# EAGLE schematic pgab (EAGLE 7.4.0)
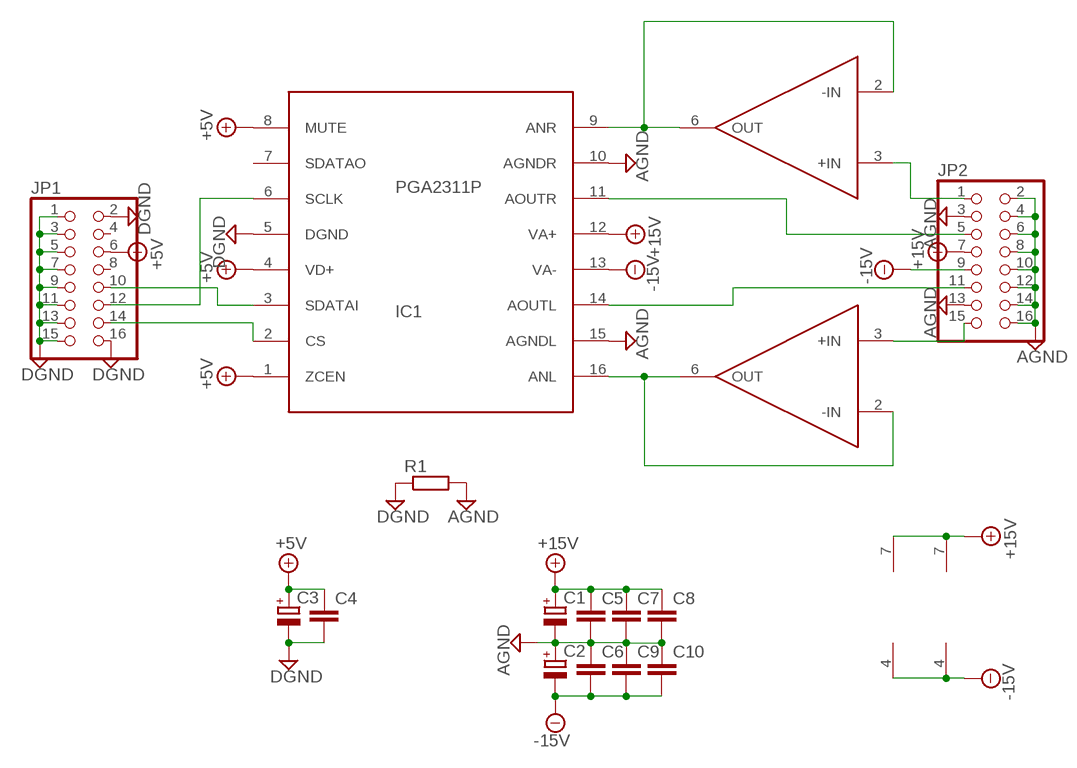
[diagram p0: schematic, sheet 1]

## Parts
C1  CPOL-EUE3.5-8  [E3,5-8]
C2  CPOL-EUE3.5-8  [E3,5-8]
C3  CPOL-EUE3.5-8  [E3,5-8]
C4  C-EU025-025X050  [C025-025X050]
C5  C-EU025-025X050  [C025-025X050]
C6  C-EU025-025X050  [C025-025X050]
C7  C-EU025-025X050  [C025-025X050]
C8  C-EU025-025X050  [C025-025X050]
C9  C-EU025-025X050  [C025-025X050]
C10  C-EU025-025X050  [C025-025X050]
IC1  PGA2311P  [DIL16]
JP1  PINHD-2X8  [2X08]
JP2  PINHD-2X8  [2X08]
R1  R-EU_0207/10  [0207/10]
U1  OPA627BP  [DIL08]
U2  OPA627BP  [DIL08]

## Nets
+5V: C3.+ C4.1 IC1.1(ZCEN) IC1.4(VD+) IC1.8(MUTE) JP1.6
+15V: C1.+ C5.1 C7.1 C8.1 IC1.12(VA+) JP2.7 U1.7(V+) U2.7(V+)
-15V: C2.- C6.2 C9.2 C10.2 IC1.13(VA-) JP2.9 U1.4(V-) U2.4(V-)
AGND: C1.- C2.+ C5.2 C6.1 C7.2 C8.2 C9.1 C10.1 IC1.10(AGNDR) IC1.15(AGNDL) JP2.2 JP2.3 JP2.4 JP2.6 JP2.8 JP2.10 JP2.12 JP2.13 JP2.14 JP2.16 R1.2
DGND: C3.- C4.2 IC1.5(DGND) JP1.1 JP1.2 JP1.3 JP1.5 JP1.7 JP1.9 JP1.11 JP1.13 JP1.15 JP1.16 R1.1
N$1: IC1.2(CS) JP1.14
N$2: IC1.3(SDATAI) JP1.10
N$3: IC1.6(SCLK) JP1.12
N$4: IC1.16(ANL) U2.2(-IN) U2.6(OUT)
N$5: IC1.9(ANR) U1.2(-IN) U1.6(OUT)
N$6: JP2.15 U2.3(+IN)
N$7: IC1.14(AOUTL) JP2.11
N$8: IC1.11(AOUTR) JP2.5
N$9: JP2.1 U1.3(+IN)
Unconnected: IC1.7(SDATAO) JP1.4 JP1.8

## Library data of the parts
C1-C3 = Vwvwbg:CPOL-EU: POLARIZED CAPACITOR, European symbol
C4-C10 = Vwvwbg:C-EU: CAPACITOR, European symbol
IC1 = Vwvwbg:PGA2311
JP1 JP2 = pinhead:PINHD-2X8: PIN HEADER
R1 = Vwvwbg:R-EU_: RESISTOR, European symbol
U1 U2 = Vwvwbg:OPA627BP: OPERATIONAL AMPLIFIER